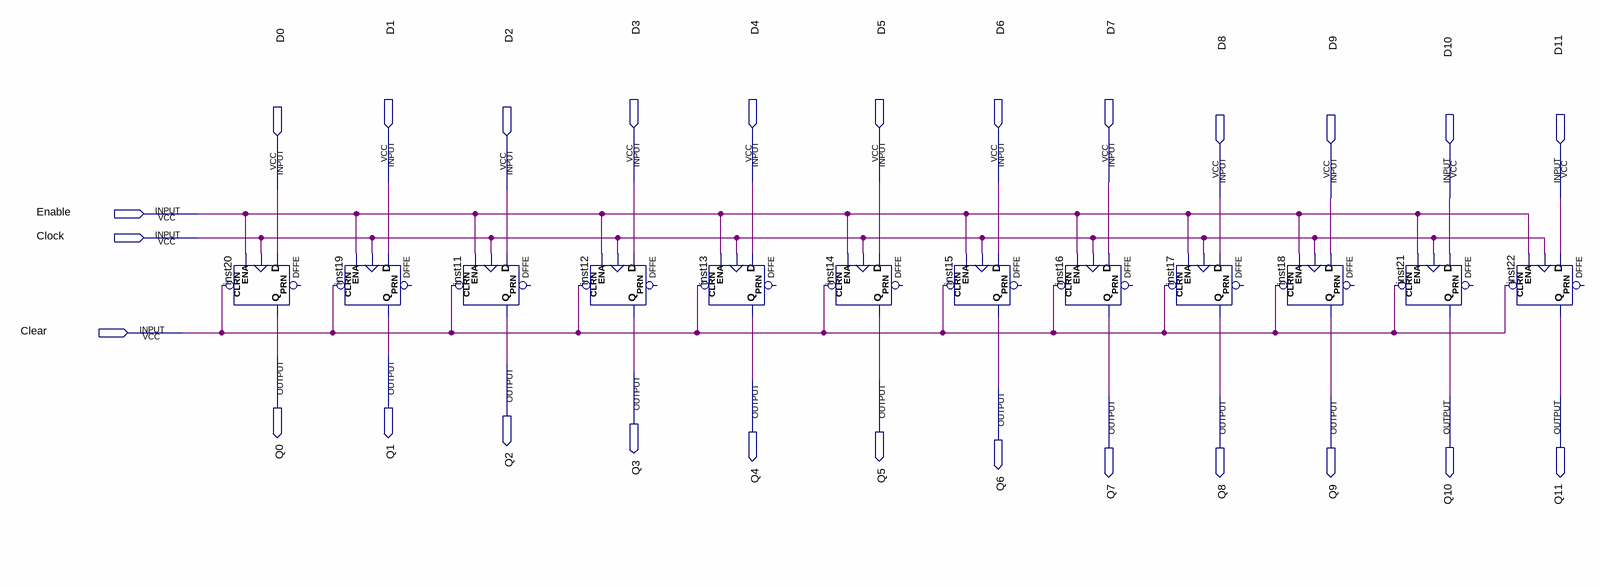
[diagram p0: schematic sheet]
// Quartus schematic Row12.bdf as structural Verilog: 12 symbols, 27 pins
module Row12 (
  input  D1,
  input  D3,
  input  D4,
  input  D5,
  input  D6,
  input  D7,
  input  D0,
  input  D2,
  input  D8,
  input  D9,
  input  D10,
  input  D11,
  input  Enable,
  input  Clock,
  input  Clear,
  output Q0,
  output Q1,
  output Q2,
  output Q3,
  output Q4,
  output Q5,
  output Q6,
  output Q7,
  output Q8,
  output Q9,
  output Q10,
  output Q11
);

  DFFE inst20 (.CLRN(Clear), .D(D0), .CLK(Clock), .ENA(Enable), .Q(Q0));  // open: PRN
  DFFE inst19 (.CLRN(Clear), .D(D1), .CLK(Clock), .ENA(Enable), .Q(Q1));  // open: PRN
  DFFE inst11 (.CLRN(Clear), .D(D2), .CLK(Clock), .ENA(Enable), .Q(Q2));  // open: PRN
  DFFE inst12 (.CLRN(Clear), .D(D3), .CLK(Clock), .ENA(Enable), .Q(Q3));  // open: PRN
  DFFE inst13 (.CLRN(Clear), .D(D4), .CLK(Clock), .ENA(Enable), .Q(Q4));  // open: PRN
  DFFE inst14 (.CLRN(Clear), .D(D5), .CLK(Clock), .ENA(Enable), .Q(Q5));  // open: PRN
  DFFE inst15 (.CLRN(Clear), .D(D6), .CLK(Clock), .ENA(Enable), .Q(Q6));  // open: PRN
  DFFE inst16 (.CLRN(Clear), .D(D7), .CLK(Clock), .ENA(Enable), .Q(Q7));  // open: PRN
  DFFE inst17 (.CLRN(Clear), .D(D8), .CLK(Clock), .ENA(Enable), .Q(Q8));  // open: PRN
  DFFE inst18 (.CLRN(Clear), .D(D9), .CLK(Clock), .ENA(Enable), .Q(Q9));  // open: PRN
  DFFE inst21 (.CLRN(Clear), .D(D10), .CLK(Clock), .ENA(Enable), .Q(Q10));  // open: PRN
  DFFE inst22 (.CLRN(Clear), .D(D11), .CLK(Clock), .ENA(Enable), .Q(Q11));  // open: PRN
endmodule
